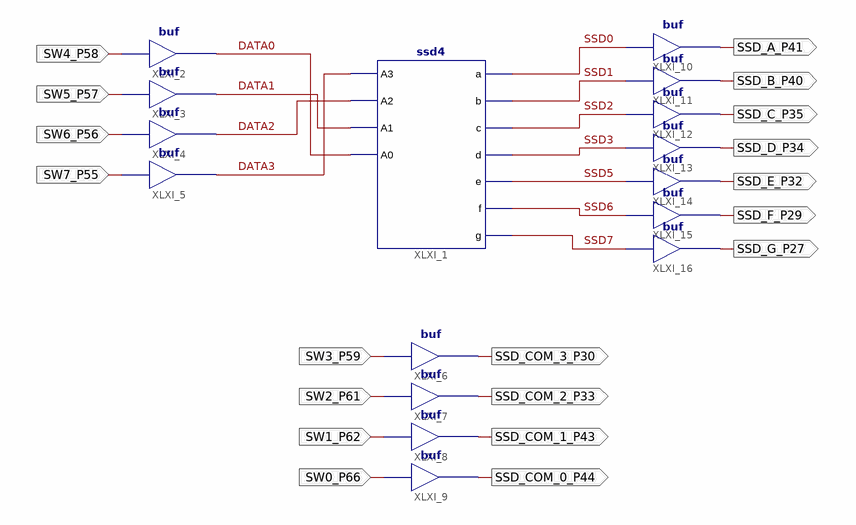
[diagram p0: schematic sheet 1]
// Xilinx ISE schematic integration.sch (spartan6) as structural Verilog: 16 symbols, 19 ports
module integration (
  input  SW3_P59,
  input  SW2_P61,
  input  SW1_P62,
  input  SW0_P66,
  input  SW4_P58,
  input  SW5_P57,
  input  SW6_P56,
  input  SW7_P55,
  output SSD_COM_3_P30,
  output SSD_COM_2_P33,
  output SSD_COM_1_P43,
  output SSD_COM_0_P44,
  output SSD_A_P41,
  output SSD_B_P40,
  output SSD_C_P35,
  output SSD_D_P34,
  output SSD_E_P32,
  output SSD_F_P29,
  output SSD_G_P27
);

  wire DATA0, DATA1, DATA2, DATA3, SSD0, SSD1, SSD2, SSD3, SSD5, SSD6, SSD7;

  ssd4 XLXI_1 (
    .a(SSD0), .A0(DATA0), .A1(DATA1), .A2(DATA2), .A3(DATA3), .b(SSD1), .c(SSD2), .d(SSD3), .e(SSD5),
    .f(SSD6), .g(SSD7));
  buf XLXI_2 (DATA0, SW4_P58);
  buf XLXI_3 (DATA1, SW5_P57);
  buf XLXI_4 (DATA2, SW6_P56);
  buf XLXI_5 (DATA3, SW7_P55);
  buf XLXI_10 (SSD_A_P41, SSD0);
  buf XLXI_11 (SSD_B_P40, SSD1);
  buf XLXI_12 (SSD_C_P35, SSD2);
  buf XLXI_13 (SSD_D_P34, SSD3);
  buf XLXI_14 (SSD_E_P32, SSD5);
  buf XLXI_15 (SSD_F_P29, SSD6);
  buf XLXI_16 (SSD_G_P27, SSD7);
  buf XLXI_6 (SSD_COM_3_P30, SW3_P59);
  buf XLXI_7 (SSD_COM_2_P33, SW2_P61);
  buf XLXI_8 (SSD_COM_1_P43, SW1_P62);
  buf XLXI_9 (SSD_COM_0_P44, SW0_P66);
endmodule
